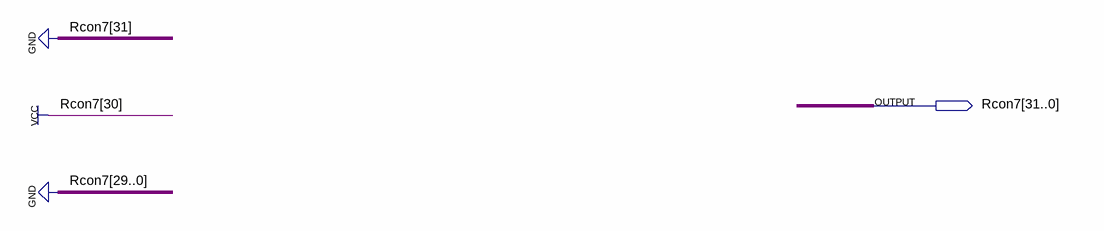
[diagram p0: schematic sheet]
// Quartus schematic Rcon7.bdf as structural Verilog: 0 symbols, 1 pins
module Rcon7 (
  output [31:0] Rcon7
);


  assign Rcon7 = 32'b01000000000000000000000000000000;
endmodule
